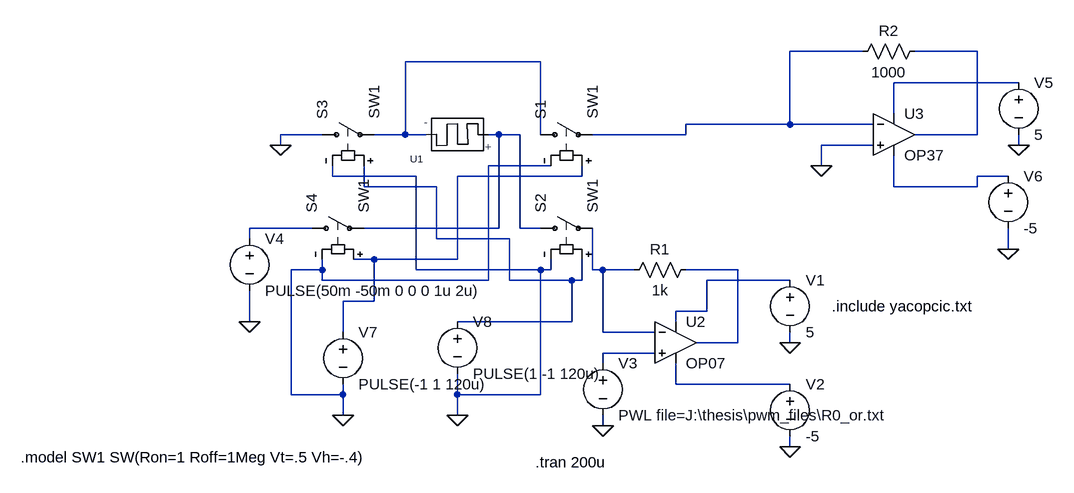
[diagram p0: schematic trial_1.asc]
trial_1.asc, the LTspice schematic file:
Version 4
SHEET 1 2588 808
WIRE 2288 160 2176 160
WIRE 2464 160 2368 160
WIRE 1792 176 1584 176
WIRE 2528 208 2336 208
WIRE 2336 256 2336 208
WIRE 2176 272 2176 160
WIRE 2176 272 2016 272
WIRE 2304 272 2176 272
WIRE 1456 288 1392 288
WIRE 1584 288 1584 176
WIRE 1584 288 1536 288
WIRE 1616 288 1584 288
WIRE 1728 288 1712 288
WIRE 1760 288 1728 288
WIRE 1792 288 1792 176
WIRE 2016 288 2016 272
WIRE 2016 288 1872 288
WIRE 2464 288 2464 160
WIRE 2464 288 2368 288
WIRE 1392 304 1392 288
WIRE 2304 304 2224 304
WIRE 2528 304 2528 288
WIRE 1808 336 1712 336
WIRE 2224 336 2224 304
WIRE 1472 352 1472 336
WIRE 1600 352 1472 352
WIRE 1856 352 1856 336
WIRE 1856 352 1664 352
WIRE 2512 352 2464 352
WIRE 1520 368 1520 336
WIRE 1632 368 1520 368
WIRE 2336 368 2336 320
WIRE 2464 368 2464 352
WIRE 2464 368 2336 368
WIRE 1440 432 1344 432
WIRE 1728 432 1728 288
WIRE 1728 432 1520 432
WIRE 1760 432 1760 288
WIRE 1792 432 1760 432
WIRE 1344 448 1344 432
WIRE 1632 448 1632 368
WIRE 1744 448 1632 448
WIRE 2512 464 2512 432
WIRE 1536 480 1504 480
WIRE 1664 480 1664 352
WIRE 1664 480 1536 480
WIRE 1456 496 1456 480
WIRE 1456 496 1408 496
WIRE 1600 496 1600 352
WIRE 1792 496 1600 496
WIRE 1808 496 1808 480
WIRE 1808 496 1792 496
WIRE 1872 496 1872 432
WIRE 1888 496 1872 496
WIRE 1936 496 1888 496
WIRE 2096 496 2016 496
WIRE 1456 512 1456 496
WIRE 1712 512 1712 336
WIRE 1712 512 1456 512
WIRE 1744 512 1744 448
WIRE 1840 512 1744 512
WIRE 1856 512 1856 480
WIRE 1856 512 1840 512
WIRE 2176 512 2048 512
WIRE 1536 544 1536 480
WIRE 1536 544 1488 544
WIRE 2048 560 2048 512
WIRE 2048 560 2000 560
WIRE 1344 576 1344 528
WIRE 1840 576 1840 512
WIRE 1840 576 1664 576
WIRE 2000 576 2000 560
WIRE 1488 592 1488 544
WIRE 1888 592 1888 496
WIRE 1968 592 1888 592
WIRE 2096 608 2096 496
WIRE 2096 608 2032 608
WIRE 2176 608 2176 592
WIRE 1968 624 1888 624
WIRE 1888 640 1888 624
WIRE 2000 672 2000 640
WIRE 2176 672 2000 672
WIRE 1408 688 1408 496
WIRE 1488 688 1488 672
WIRE 1488 688 1408 688
WIRE 1664 688 1664 656
WIRE 1792 688 1792 496
WIRE 1792 688 1664 688
WIRE 1488 720 1488 688
WIRE 1664 720 1664 688
WIRE 1888 736 1888 720
WIRE 2176 768 2176 752
FLAG 1392 304 0
FLAG 2176 608 0
FLAG 2176 768 0
FLAG 1888 736 0
FLAG 1344 576 0
FLAG 2224 336 0
FLAG 2512 464 0
FLAG 2528 304 0
FLAG 1488 720 0
FLAG 1664 720 0
SYMBOL memristormodel 1632 288 R180
SYMATTR InstName U1
SYMATTR Value MEM_YAKOPCIC
SYMBOL Opamps\\OP07 2000 544 R0
SYMATTR InstName U2
SYMBOL res 2032 480 R90
WINDOW 0 0 56 VBottom 2
WINDOW 3 32 56 VTop 2
SYMATTR InstName R1
SYMATTR Value 1k
SYMBOL voltage 2176 496 R0
WINDOW 123 0 0 Left 2
WINDOW 39 0 0 Left 2
SYMATTR InstName V1
SYMATTR Value 5
SYMBOL voltage 2176 656 R0
WINDOW 123 0 0 Left 2
WINDOW 39 0 0 Left 2
SYMATTR InstName V2
SYMATTR Value -5
SYMBOL voltage 1888 624 R0
WINDOW 123 0 0 Left 2
WINDOW 39 0 0 Left 2
SYMATTR InstName V3
SYMATTR Value PWL file=J:\thesis\pwm_files\R0_or.txt
SYMBOL sw 1776 288 R270
SYMATTR InstName S1
SYMATTR Value SW1
SYMBOL sw 1776 432 R270
SYMATTR InstName S2
SYMATTR Value SW1
SYMBOL sw 1440 288 R270
SYMATTR InstName S3
SYMATTR Value SW1
SYMBOL sw 1424 432 R270
SYMATTR InstName S4
SYMATTR Value SW1
SYMBOL voltage 1344 432 R0
WINDOW 123 0 0 Left 2
WINDOW 39 0 0 Left 2
SYMATTR InstName V4
SYMATTR Value PULSE(50m -50m 0 0 0 1u 2u)
SYMBOL res 2384 144 R90
WINDOW 0 0 56 VBottom 2
WINDOW 3 32 56 VTop 2
SYMATTR InstName R2
SYMATTR Value 1000
SYMBOL voltage 2528 192 R0
WINDOW 123 0 0 Left 2
WINDOW 39 0 0 Left 2
SYMATTR InstName V5
SYMATTR Value 5
SYMBOL voltage 2512 336 R0
WINDOW 123 0 0 Left 2
WINDOW 39 0 0 Left 2
SYMATTR InstName V6
SYMATTR Value -5
SYMBOL voltage 1488 576 R0
WINDOW 123 0 0 Left 2
WINDOW 39 0 0 Left 2
SYMATTR InstName V7
SYMATTR Value PULSE(-1 1 120u)
SYMBOL voltage 1664 560 R0
WINDOW 123 0 0 Left 2
WINDOW 39 0 0 Left 2
SYMATTR InstName V8
SYMATTR Value PULSE(1 -1 120u)
SYMBOL Opamps\\OP37 2336 224 R0
SYMATTR InstName U3
TEXT 2240 552 Left 2 !.include yacopcic.txt
TEXT 1784 792 Left 2 !.tran 200u
TEXT 992 784 Left 2 !.model SW1 SW(Ron=1 Roff=1Meg Vt=.5 Vh=-.4)

The netlist it stands for:
* trial_1.asc
XU1 N005 N003 M MEM_YAKOPCIC  ; pins + -
XU2 N013 N010 N012 N014 N011 LT1001  ; OP07, pins In+ In- V+ V- OUT
R1 N011 N010 1k
V1 N012 0 5
V2 N014 0 -5
V3 N013 0 PWL file=J:\thesis\pwm_files\R0_or.txt
S1 N003 N001 N006 0 SW1
S2 N005 N010 N008 0 SW1
S3 0 N003 N008 0 SW1
S4 N009 N005 N006 0 SW1
V4 N009 0 PULSE(50m -50m 0 0 0 1u 2u)
R2 N002 N001 1000
V5 N004 0 5
V6 N007 0 -5
V7 N006 0 PULSE(-1 1 120u)
V8 N008 0 PULSE(1 -1 120u)
XU3 0 N001 N004 N007 N002 LT1037  ; OP37, pins In+ In- V+ V- OUT
.include yacopcic.txt
.tran 200u
.model SW1 SW(Ron=1 Roff=1Meg Vt=.5 Vh=-.4)
.lib LTC.lib
.backanno
.end